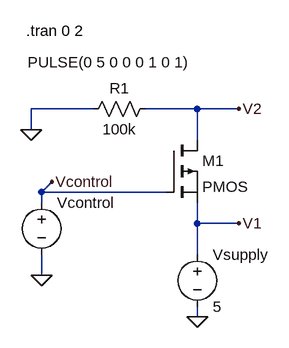
[diagram p0: schematic project2_q1.asc]
project2_q1.asc, the LTspice schematic file:
Version 4
SHEET 1 880 680
WIRE 176 -224 80 -224
WIRE 336 -224 256 -224
WIRE 400 -224 336 -224
WIRE 80 -192 80 -224
WIRE 336 -176 336 -224
WIRE 96 -96 112 -112
WIRE 288 -96 96 -96
WIRE 96 -80 96 -96
WIRE 336 -48 336 -80
WIRE 400 -48 336 -48
WIRE 336 0 336 -48
WIRE 96 32 96 0
WIRE 336 96 336 80
FLAG 96 32 0
FLAG 336 96 0
FLAG 80 -192 0
FLAG 400 -224 V2
FLAG 112 -112 Vcontrol
FLAG 400 -48 V1
SYMBOL voltage 96 -96 R0
WINDOW 3 -21 -200 Left 2
WINDOW 123 0 0 Left 0
WINDOW 39 0 0 Left 0
SYMATTR Value PULSE(0 5 0 0 0 1 0 1)
SYMATTR InstName Vcontrol
SYMBOL voltage 336 -16 R0
WINDOW 123 0 0 Left 0
WINDOW 39 0 0 Left 0
SYMATTR InstName Vsupply
SYMATTR Value 5
SYMBOL res 160 -208 R270
WINDOW 0 32 56 VTop 2
WINDOW 3 0 56 VBottom 2
SYMATTR InstName R1
SYMATTR Value 100k
SYMBOL pmos 288 -176 R0
SYMATTR InstName M1
TEXT 72 -344 Left 2 !.tran 0 2

The netlist it stands for:
* project2_q1.asc
Vcontrol Vcontrol 0 PULSE(0 5 0 0 0 1 0 1)
Vsupply V1 0 5
R1 0 V2 100k
M1 V2 Vcontrol V1 V1 PMOS
.model NMOS NMOS
.model PMOS PMOS
.lib standard.mos
.tran 0 2
.backanno
.end